# Altium schematic sheet decoupling.SchDoc
size A4
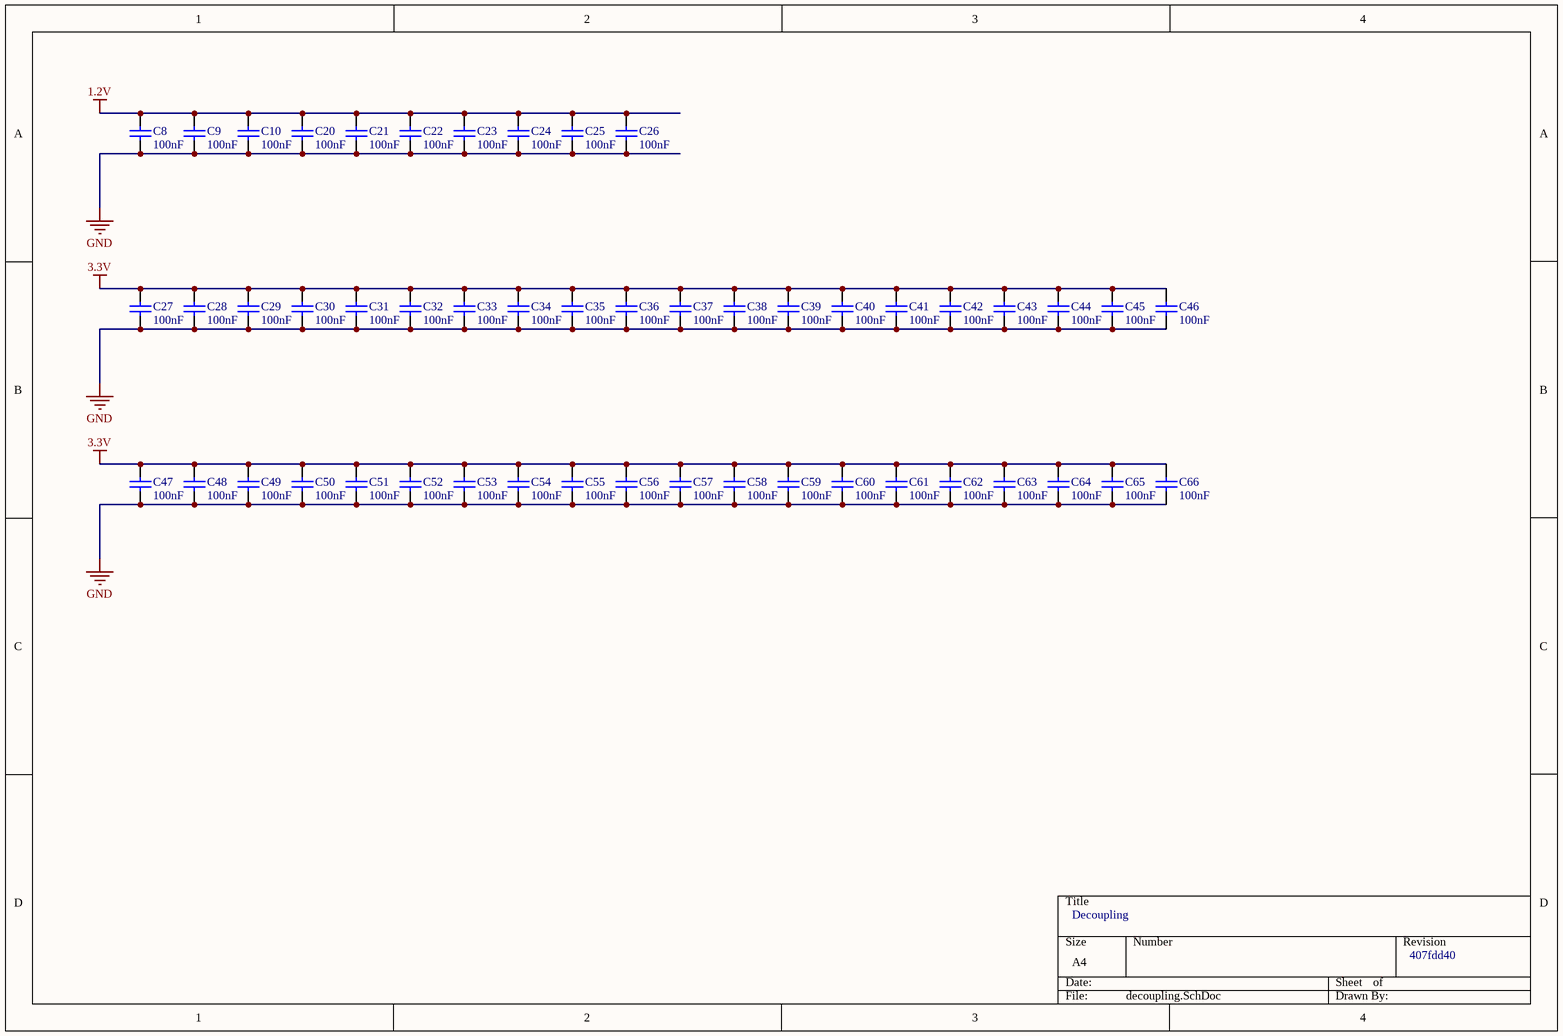
[diagram p0: decoupling.SchDoc]

## Parts
C8  value 100nF  [CAPC1210(3225)100_L]  (hidden comment: CAP 10pF 100V 1210(3225))
C9  value 100nF  [CAPC1210(3225)100_L]  (hidden comment: CAP 10pF 100V 1210(3225))
C10  value 100nF  [CAPC1210(3225)100_L]  (hidden comment: CAP 10pF 100V 1210(3225))
C20  value 100nF  [CAPC1210(3225)100_L]  (hidden comment: CAP 100nF 100V 1210(3225))
C21  value 100nF  [CAPC1210(3225)100_L]  (hidden comment: CAP 100nF 100V 1210(3225))
C22  value 100nF  [CAPC1210(3225)100_L]  (hidden comment: CAP 100nF 100V 1210(3225))
C23  value 100nF  [CAPC1210(3225)100_L]  (hidden comment: CAP 100nF 100V 1210(3225))
C24  value 100nF  [CAPC1210(3225)100_L]  (hidden comment: CAP 100nF 100V 1210(3225))
C25  value 100nF  [CAPC1210(3225)100_L]  (hidden comment: CAP 100nF 100V 1210(3225))
C26  value 100nF  [CAPC1210(3225)100_L]  (hidden comment: CAP 100nF 100V 1210(3225))
C27  value 100nF  [CAPC1210(3225)100_L]  (hidden comment: CAP 100nF 100V 1210(3225))
C28  value 100nF  [CAPC1210(3225)100_L]  (hidden comment: CAP 100nF 100V 1210(3225))
C29  value 100nF  [CAPC1210(3225)100_L]  (hidden comment: CAP 100nF 100V 1210(3225))
C30  value 100nF  [CAPC1210(3225)100_L]  (hidden comment: CAP 100nF 100V 1210(3225))
C31  value 100nF  [CAPC1210(3225)100_L]  (hidden comment: CAP 100nF 100V 1210(3225))
C32  value 100nF  [CAPC1210(3225)100_L]  (hidden comment: CAP 100nF 100V 1210(3225))
C33  value 100nF  [CAPC1210(3225)100_L]  (hidden comment: CAP 100nF 100V 1210(3225))
C34  value 100nF  [CAPC1210(3225)100_L]  (hidden comment: CAP 100nF 100V 1210(3225))
C35  value 100nF  [CAPC1210(3225)100_L]  (hidden comment: CAP 100nF 100V 1210(3225))
C36  value 100nF  [CAPC1210(3225)100_L]  (hidden comment: CAP 100nF 100V 1210(3225))
C37  value 100nF  [CAPC1210(3225)100_L]  (hidden comment: CAP 100nF 100V 1210(3225))
C38  value 100nF  [CAPC1210(3225)100_L]  (hidden comment: CAP 100nF 100V 1210(3225))
C39  value 100nF  [CAPC1210(3225)100_L]  (hidden comment: CAP 100nF 100V 1210(3225))
C40  value 100nF  [CAPC1210(3225)100_L]  (hidden comment: CAP 100nF 100V 1210(3225))
C41  value 100nF  [CAPC1210(3225)100_L]  (hidden comment: CAP 100nF 100V 1210(3225))
C42  value 100nF  [CAPC1210(3225)100_L]  (hidden comment: CAP 100nF 100V 1210(3225))
C43  value 100nF  [CAPC1210(3225)100_L]  (hidden comment: CAP 100nF 100V 1210(3225))
C44  value 100nF  [CAPC1210(3225)100_L]  (hidden comment: CAP 100nF 100V 1210(3225))
C45  value 100nF  [CAPC1210(3225)100_L]  (hidden comment: CAP 100nF 100V 1210(3225))
C46  value 100nF  [CAPC1210(3225)100_L]  (hidden comment: CAP 100nF 100V 1210(3225))
C47  value 100nF  [CAPC1210(3225)100_L]  (hidden comment: CAP 100nF 100V 1210(3225))
C48  value 100nF  [CAPC1210(3225)100_L]  (hidden comment: CAP 100nF 100V 1210(3225))
C49  value 100nF  [CAPC1210(3225)100_L]  (hidden comment: CAP 100nF 100V 1210(3225))
C50  value 100nF  [CAPC1210(3225)100_L]  (hidden comment: CAP 100nF 100V 1210(3225))
C51  value 100nF  [CAPC1210(3225)100_L]  (hidden comment: CAP 100nF 100V 1210(3225))
C52  value 100nF  [CAPC1210(3225)100_L]  (hidden comment: CAP 100nF 100V 1210(3225))
C53  value 100nF  [CAPC1210(3225)100_L]  (hidden comment: CAP 100nF 100V 1210(3225))
C54  value 100nF  [CAPC1210(3225)100_L]  (hidden comment: CAP 100nF 100V 1210(3225))
C55  value 100nF  [CAPC1210(3225)100_L]  (hidden comment: CAP 100nF 100V 1210(3225))
C56  value 100nF  [CAPC1210(3225)100_L]  (hidden comment: CAP 100nF 100V 1210(3225))
C57  value 100nF  [CAPC1210(3225)100_L]  (hidden comment: CAP 100nF 100V 1210(3225))
C58  value 100nF  [CAPC1210(3225)100_L]  (hidden comment: CAP 100nF 100V 1210(3225))
C59  value 100nF  [CAPC1210(3225)100_L]  (hidden comment: CAP 100nF 100V 1210(3225))
C60  value 100nF  [CAPC1210(3225)100_L]  (hidden comment: CAP 100nF 100V 1210(3225))
C61  value 100nF  [CAPC1210(3225)100_L]  (hidden comment: CAP 100nF 100V 1210(3225))
C62  value 100nF  [CAPC1210(3225)100_L]  (hidden comment: CAP 100nF 100V 1210(3225))
C63  value 100nF  [CAPC1210(3225)100_L]  (hidden comment: CAP 100nF 100V 1210(3225))
C64  value 100nF  [CAPC1210(3225)100_L]  (hidden comment: CAP 100nF 100V 1210(3225))
C65  value 100nF  [CAPC1210(3225)100_L]  (hidden comment: CAP 100nF 100V 1210(3225))
C66  value 100nF  [CAPC1210(3225)100_L]  (hidden comment: CAP 100nF 100V 1210(3225))

## Nets
1.2V: C8.1 C9.1 C10.1 C20.1 C21.1 C22.1 C23.1 C24.1 C25.1 C26.1
3.3V: C27.1 C28.1 C29.1 C30.1 C31.1 C32.1 C33.1 C34.1 C35.1 C36.1 C37.1 C38.1 C39.1 C40.1 C41.1 C42.1 C43.1 C44.1 C45.1 C46.1 C47.1 C48.1 C49.1 C50.1 C51.1 C52.1 C53.1 C54.1 C55.1 C56.1 C57.1 C58.1 C59.1 C60.1 C61.1 C62.1 C63.1 C64.1 C65.1 C66.1
GND: C8.2 C9.2 C10.2 C20.2 C21.2 C22.2 C23.2 C24.2 C25.2 C26.2 C27.2 C28.2 C29.2 C30.2 C31.2 C32.2 C33.2 C34.2 C35.2 C36.2 C37.2 C38.2 C39.2 C40.2 C41.2 C42.2 C43.2 C44.2 C45.2 C46.2 C47.2 C48.2 C49.2 C50.2 C51.2 C52.2 C53.2 C54.2 C55.2 C56.2 C57.2 C58.2 C59.2 C60.2 C61.2 C62.2 C63.2 C64.2 C65.2 C66.2

## Notes on the sheet
- Decoupling
- 407fdd40

## Library data of the parts
C8-C10 C20-C66 = CMP-1038-00005-1: CAP 100nF 100V ±0.25pF 1210 (3225 Metric) Thickness 1mm SMD; Case-Metric: 3225; Case-EIA: 1210; Max Thickness: 1 mm; Rated Voltage: 100 V; Technology: SMT; Tolerance: ±0.25pF